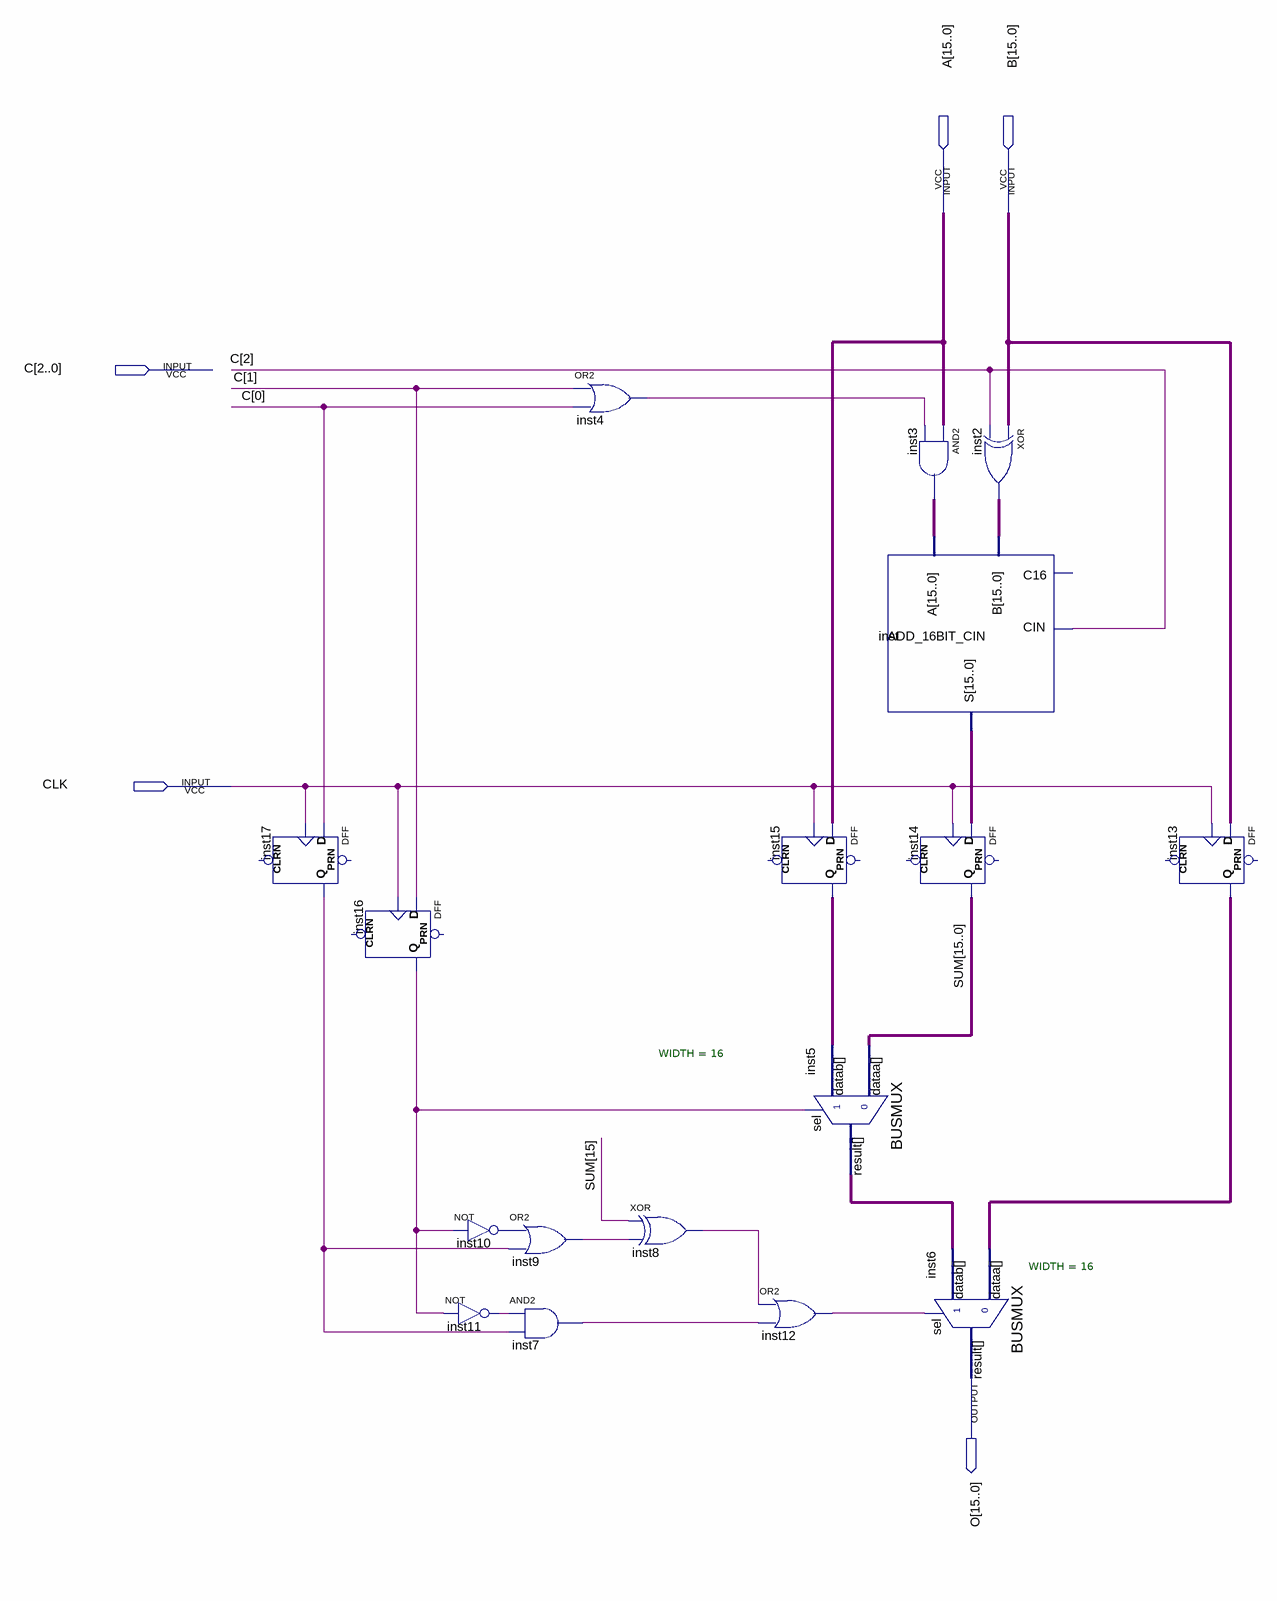
[diagram p0: schematic sheet]
// Quartus schematic AU_PIPELINE.bdf as structural Verilog: 17 symbols, 5 pins
module AU_PIPELINE (
  input  [15:0] A,
  input  [15:0] B,
  input  [2:0] C,
  input  CLK,
  output [15:0] O
);

  wire inst4_out, inst7_out, inst8_out, inst9_out, inst10_out, inst11_out, inst12_out, inst16_q, inst17_q;
  wire [15:0] inst2_out, inst3_out, inst5_result, inst13_q, inst15_q, inst_s, SUM;

  DFF inst17 (.CLK(CLK), .D(C[0]), .Q(inst17_q));  // open: CLRN, PRN
  DFF inst16 (.CLK(CLK), .D(C[1]), .Q(inst16_q));  // open: CLRN, PRN
  not inst10 (inst10_out, inst16_q);
  not inst11 (inst11_out, inst16_q);
  or inst4 (inst4_out, C[1], C[0]);
  or inst9 (inst9_out, inst10_out, inst17_q);
  and inst7 (inst7_out, inst11_out, inst17_q);
  xor inst8 (inst8_out, SUM[15], inst9_out);
  DFF inst15[15:0] (.CLK(CLK), .D(A), .Q(inst15_q));  // open: CLRN, PRN
  or inst12 (inst12_out, inst8_out, inst7_out);
  ADD_16BIT_CIN inst (.A(inst3_out), .B(inst2_out), .CIN(C[2]), .S(inst_s));  // open: C16
  BUSMUX #(.WIDTH(16)) inst5 (.datab(inst15_q), .sel(inst16_q), .dataa(SUM), .result(inst5_result));
  assign inst3_out = A & {16{inst4_out}};  // AND2 inst3, 16 bits wide
  DFF inst14[15:0] (.CLK(CLK), .D(inst_s), .Q(SUM));  // open: CLRN, PRN
  BUSMUX #(.WIDTH(16)) inst6 (.datab(inst5_result), .sel(inst12_out), .dataa(inst13_q), .result(O));
  assign inst2_out = B ^ {16{C[2]}};  // XOR inst2, 16 bits wide
  DFF inst13[15:0] (.CLK(CLK), .D(B), .Q(inst13_q));  // open: CLRN, PRN
endmodule
